# Altium schematic sheet Z80Console0000.SchDoc
size A4; SheetNumber: 1; SheetTotal: 3
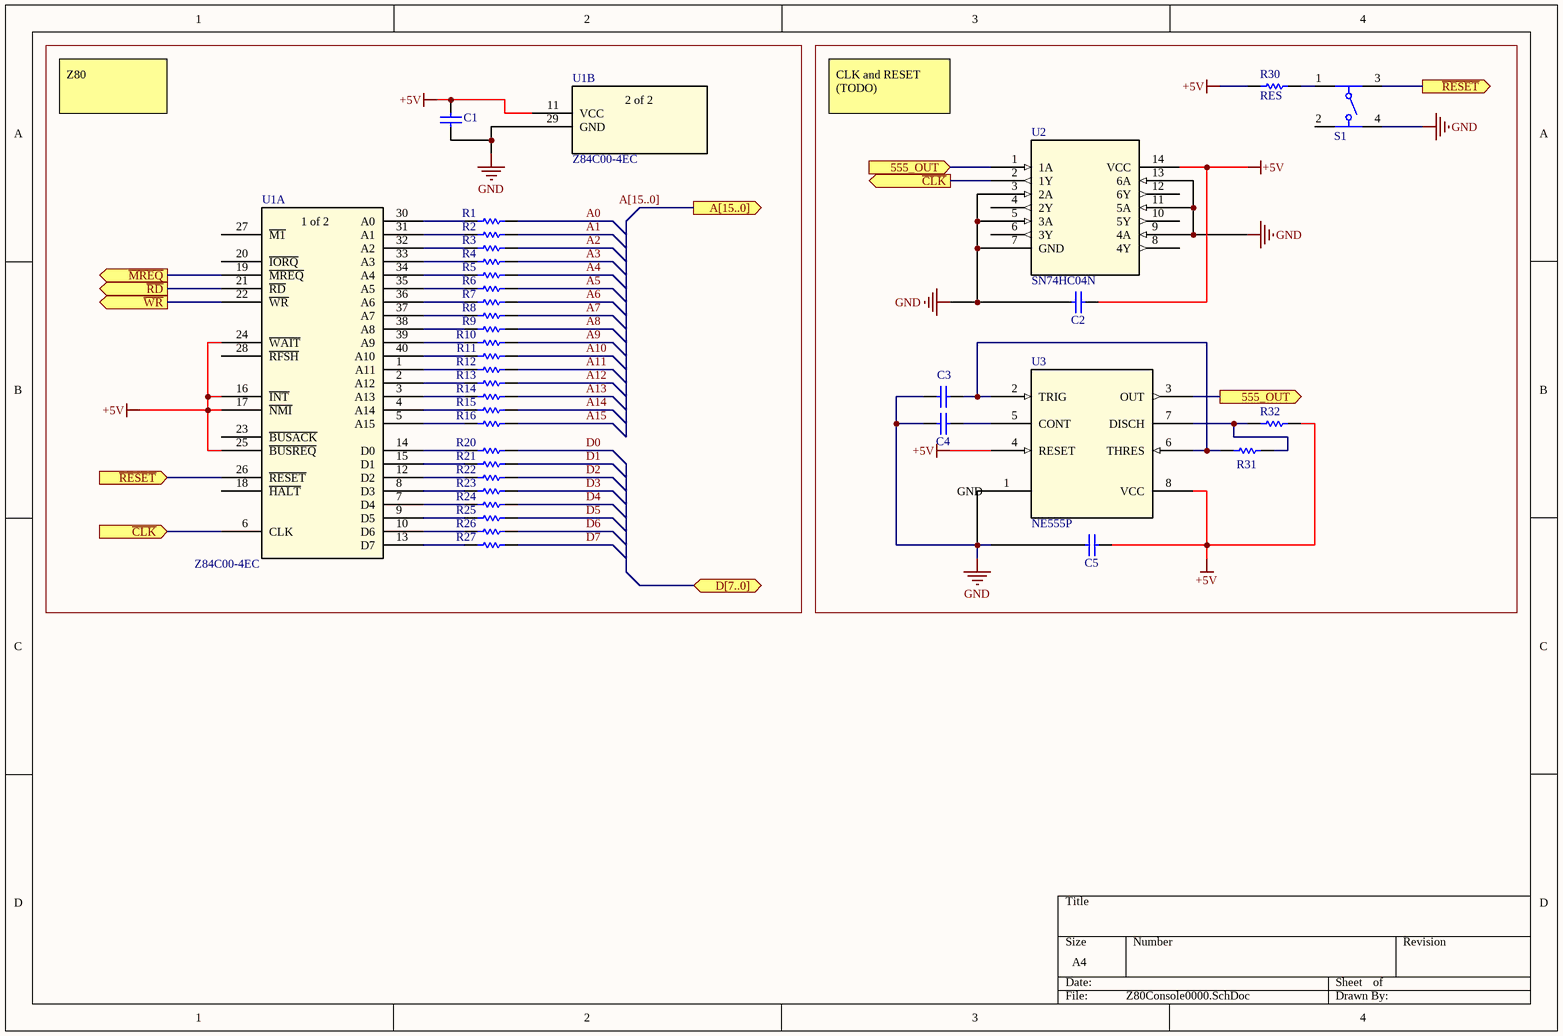
[diagram p0: Z80Console0000.SchDoc]

## Parts
C1  CAP  [CAPC0603(1608)100_N]  (value not drawn)
C2  CAP  [CAPC0603(1608)100_N]  (value not drawn)
C3  CAP  [CAPC0603(1608)100_N]  (value not drawn)
C4  CAP  [CAPC0603(1608)100_N]  (value not drawn)
C5  CAP  [CAPC0603(1608)100_N]  (value not drawn)
R1  RES  [RES_2512_MELF]  (value not drawn)
R2  RES  [RES_2512_MELF]  (value not drawn)
R3  RES  [RES_2512_MELF]  (value not drawn)
R4  RES  [RES_2512_MELF]  (value not drawn)
R5  RES  [RES_2512_MELF]  (value not drawn)
R6  RES  [RES_2512_MELF]  (value not drawn)
R7  RES  [RES_2512_MELF]  (value not drawn)
R8  RES  [RES_2512_MELF]  (value not drawn)
R9  RES  [RES_2512_MELF]  (value not drawn)
R10  RES  [RES_2512_MELF]  (value not drawn)
R11  RES  [RES_2512_MELF]  (value not drawn)
R12  RES  [RES_2512_MELF]  (value not drawn)
R13  RES  [RES_2512_MELF]  (value not drawn)
R14  RES  [RES_2512_MELF]  (value not drawn)
R15  RES  [RES_2512_MELF]  (value not drawn)
R16  RES  [RES_2512_MELF]  (value not drawn)
R20  RES  [RES_2512_MELF]  (value not drawn)
R21  RES  [RES_2512_MELF]  (value not drawn)
R22  RES  [RES_2512_MELF]  (value not drawn)
R23  RES  [RES_2512_MELF]  (value not drawn)
R24  RES  [RES_2512_MELF]  (value not drawn)
R25  RES  [RES_2512_MELF]  (value not drawn)
R26  RES  [RES_2512_MELF]  (value not drawn)
R27  RES  [RES_2512_MELF]  (value not drawn)
R30  RES  [RES_2512_MELF]
R31  RES  [RES_2512_MELF]  (value not drawn)
R32  RES  [RES_2512_MELF]  (value not drawn)
S1  430156043726  [4301x60437x6_6x6x4.3]  (value not drawn)
U1  Z84C00-4EC  [DIP40_600_ZIL]  (parts A,B of 2)
U2  SN74HC04N  [N14]
U3  NE555P  [P8]

## Ports
555_OUT (in, see Z80Console0000[4B]), 555_OUT (out, see Z80Console0000[3A]), A[15..0] (out, see Z80Console0001[1B], Z80Console0001[1D], Z80Console0001[3A], Z80Console0001[3C], Z80Console0002[1A], Z80Console0002[2C], Z80Console0002[3A], Z80Console0002[5A]), D[7..0] (bidir, see Z80Console0001[2B], Z80Console0001[2C], Z80Console0002[1C]), ~{CLK} (in, see Z80Console0000[3A]), ~{CLK} (out, see Z80Console0000[1C]), ~{MREQ} (out, see Z80Console0001[5A], Z80Console0001[5C]), ~{RD} (out, see Z80Console0001[5A]), ~{RESET} (in, see Z80Console0000[4A]), ~{RESET} (out, see Z80Console0000[1B]), ~{WR} (out, see Z80Console0001[2C], Z80Console0002[5C])

## Nets
+5V: C1.2 C2.1 C5.2 R30.2 R32.1 U1.11(VCC) U1.16(~{INT}) U1.17(~{NMI}) U1.24(~{WAIT}) U1.25(~{BUSREQ}) U2.14(VCC) U3.4(RESET) U3.8(VCC)
GND: C1.1 C2.2 C3.2 C4.2 C5.1 S1.4 U1.29(GND) U2.3(2A) U2.5(3A) U2.7(GND) U2.9(4A) U2.11(5A) U2.13(6A)
555_OUT: U2.1(1A) U3.3(OUT) ; port 555_OUT
~{CLK}: U1.6(CLK) U2.2(1Y) ; port ~{CLK}
~{MREQ}: U1.19(~{MREQ}) ; port ~{MREQ}
~{RD}: U1.21(~{RD}) ; port ~{RD}
~{RESET}: S1.3 U1.26(~{RESET}) ; port ~{RESET}
~{WR}: U1.22(~{WR}) ; port ~{WR}
A0: R1.1
A1: R2.1
A2: R3.1
A3: R4.1
A4: R5.1
A5: R6.1
A6: R7.1
A7: R8.1
A8: R9.1
A9: R10.1
A10: R11.1
A11: R12.1
A12: R13.1
A13: R14.1
A14: R15.1
A15: R16.1
D0: R20.1
D1: R21.1
D2: R22.1
D3: R23.1
D4: R24.1
D5: R25.1
D6: R26.1
D7: R27.1
NetC3_1: C3.1 R31.2 U3.2(TRIG) U3.6(THRES)
NetC4_1: C4.1 U3.5(CONT)
NetR1_2: R1.2 U1.30(A0)
NetR2_2: R2.2 U1.31(A1)
NetR3_2: R3.2 U1.32(A2)
NetR4_2: R4.2 U1.33(A3)
NetR5_2: R5.2 U1.34(A4)
NetR6_2: R6.2 U1.35(A5)
NetR7_2: R7.2 U1.36(A6)
NetR8_2: R8.2 U1.37(A7)
NetR9_2: R9.2 U1.38(A8)
NetR10_2: R10.2 U1.39(A9)
NetR11_2: R11.2 U1.40(A10)
NetR12_2: R12.2 U1.1(A11)
NetR13_2: R13.2 U1.2(A12)
NetR14_2: R14.2 U1.3(A13)
NetR15_2: R15.2 U1.4(A14)
NetR16_2: R16.2 U1.5(A15)
NetR20_2: R20.2 U1.14(D0)
NetR21_2: R21.2 U1.15(D1)
NetR22_2: R22.2 U1.12(D2)
NetR23_2: R23.2 U1.8(D3)
NetR24_2: R24.2 U1.7(D4)
NetR25_2: R25.2 U1.9(D5)
NetR26_2: R26.2 U1.10(D6)
NetR27_2: R27.2 U1.13(D7)
NetR30_1: R30.1 S1.1
NetR31_1: R31.1 R32.2 U3.7(DISCH)

Not connected (* = marked no-connect by the designer): S1 2; U1 18(~{HALT}) 20(~{IORQ}) 23(~{BUSACK}) 27(~{M1}) 28(~{RFSH}); U2 4(2Y) 6(3Y) 8(4Y) 10(5Y) 12(6Y); U3 1(GND)

## Buses and harness runs
bus A[15..0] = port A[15..0]

## Notes on the sheet
- Z80
- CLK and RESET
  (TODO)
- (in symbol Z84C00-4EC, part A) 1 of 2
- (in symbol Z84C00-4EC, part B) 2 of 2

## Library data of the parts
S1 = 430156043726: WS-TATV 6x6mm Tact Switch, THT version; Operation Force: 260g; ComponentLink1Description: Manufacturer; ComponentLink1URL: http://www.we-online.de; ComponentLink2Description: Datasheet; ComponentLink2URL: http://katalog.we-online.de/em/datasheet/4301x6xxx7x6.pdf; Part Number: 430156043726; Published Date: June 2017; Publisher: Wurth Elektronik; Size: 6x6x4.3 mm; Life Cycle: 200000 cycles
U1 = Z84C00-4EC: No Description Available; Manufacturer_Name: Littelfuse Inc; Copyright: Copyright (C) 2025 Ultra Librarian. All rights reserved.; Manufacturer_Part_Number: Z84C00-4EC; RefDes: RefDes; Type: Type
U2 = SN74HC04N: 6-ch, 2-V to 6-V inverters 14-PDIP -40 to 85; Manufacturer_Name: Texas Instruments; Copyright: Copyright (C) 2025 Ultra Librarian. All rights reserved.; Manufacturer_Part_Number: SN74HC04N; Datasheet: https://www.ti.com/lit/gpn/sn74hc04; RefDes: RefDes; Type: Type
U3 = NE555P: Single Precision Timer 8-PDIP 0 to 70; Manufacturer_Name: Texas Instruments; Copyright: Copyright (C) 2025 Ultra Librarian. All rights reserved.; Manufacturer_Part_Number: NE555P; Datasheet: https://www.ti.com/lit/gpn/ne555; RefDes: RefDes; Type: Type